# Altium project RL02.PrjPcb
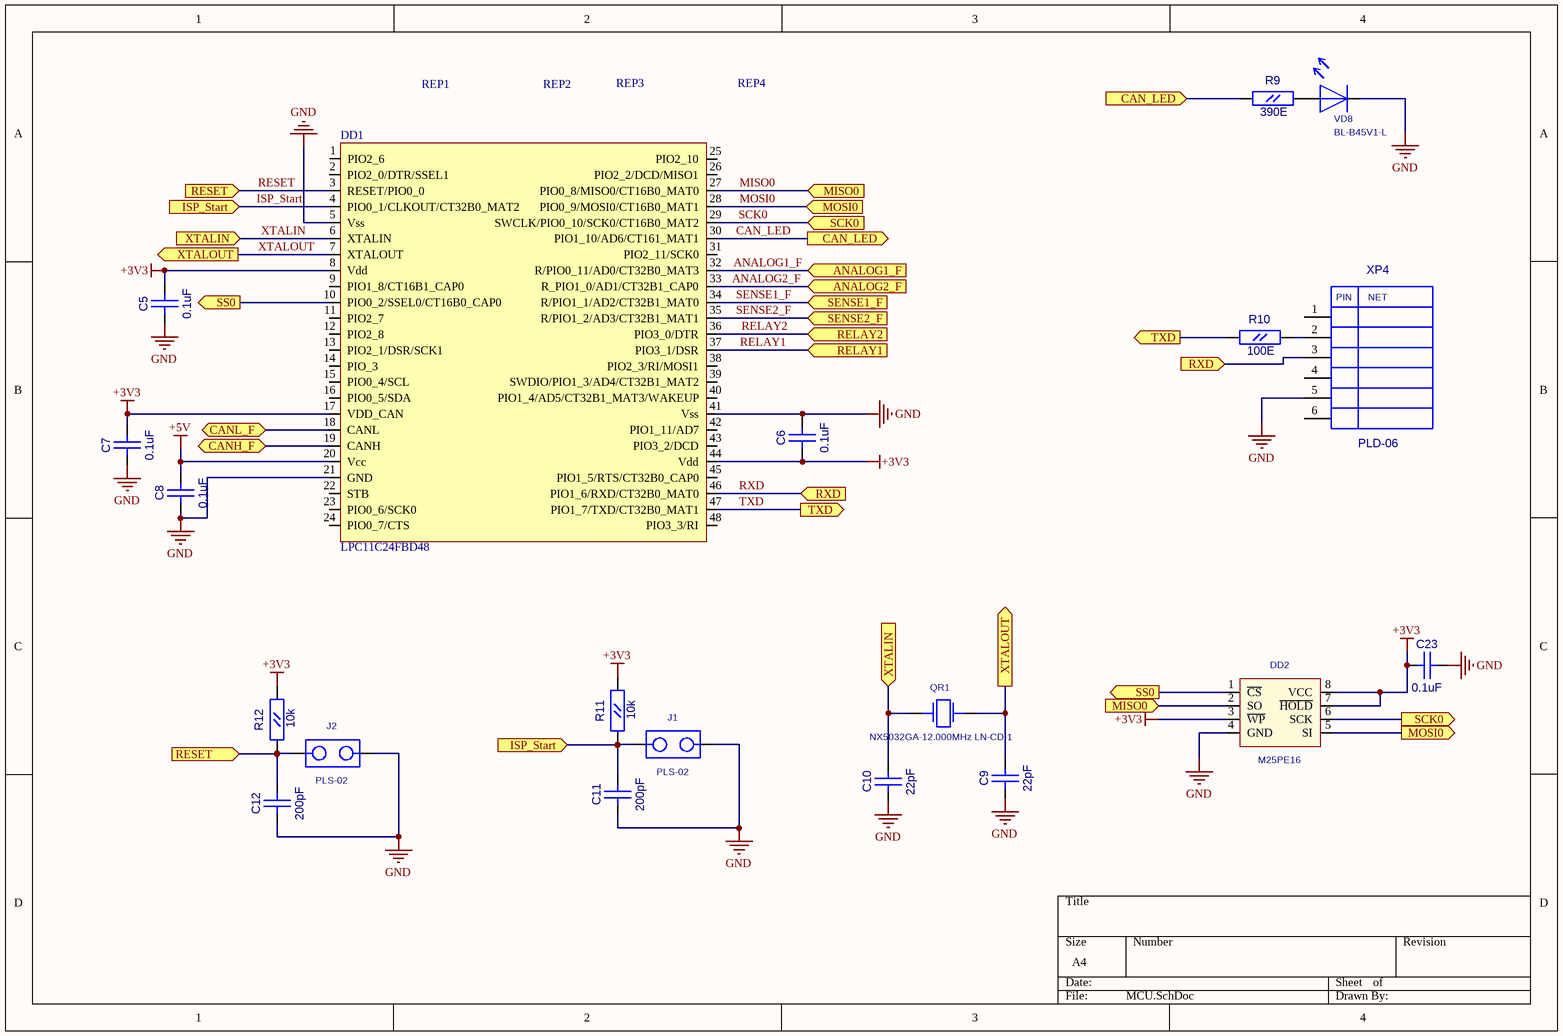
[diagram p0: MCU.SchDoc]
3 sheets, 65 parts. Net scope: flat (ports and power ports of the same name join across sheets).
Board file: RL02.PcbDoc
Sheets:
  MCU.SchDoc
  Power.SchDoc
  Relays.SchDoc

## Sheet MCU.SchDoc
size A4

### Parts
C5  0.1uF  [CC0603]
C6  0.1uF  [CC0603]
C7  0.1uF  [CC0603]
C8  0.1uF  [CC0603]
C9  22pF  [CC0603]
C10  22pF  [CC0603]
C11  200pF  [CC0603]
C12  200pF  [CC0603]
C23  0.1uF  [CC0603]
DD1  LPC11C24FBD48  [LQFP-48]
DD2  M25PE16  [EIAJ_SO8]
J1  PLS-02  [PLS-02]
J2  PLS-02  [PLS-02]
QR1  NX5032GA-12.000MHz LN-CD-1  [AC5032_2]
R9  390E  [RC0603]
R10  100E  [RC0603]
R11  10k  [RC0603]
R12  10k  [RC0603]
REP1  REPER_POINT_1.2  [REPER1.2]  (value not drawn)
REP2  REPER_POINT_1.2  [REPER1.2]  (value not drawn)
REP3  REPER_POINT_1.2  [REPER1.2]  (value not drawn)
REP4  REPER_POINT_1.2  [REPER1.2]  (value not drawn)
VD8  BL-B45V1-L  [LED3]
XP4  PLD-06  [PIN6]

### Ports
ANALOG1_F (in), ANALOG2_F (in), CAN_LED (in), CAN_LED (out), CANH_F, CANL_F, ISP_Start (in), MISO0 (in), MOSI0 (in), MOSI0 (out), RELAY1 (in), RELAY2 (in), RESET (in), RXD (in), SCK0 (in), SCK0 (out), SENSE1_F (in), SENSE2_F (in), SS0 (out), TXD (out), XTALIN (in), XTALOUT (out)

### Nets
+3V3: C5.2(B) C6.1(A) C7.2(B) C23.1(A) DD1.8(Vdd) DD1.17(VDD_CAN) DD1.44(Vdd) DD2.3(~{WP}) DD2.7(~{HOLD}) DD2.8(VCC) R11.2(B) R12.2(B)
+5V: C8.2(B) DD1.20(Vcc)
GND: C5.1(A) C6.2(B) C7.1(A) C8.1(A) C9.1(A) C10.1(A) C11.1(A) C12.1(A) C23.2(B) DD1.5(Vss) DD1.21(GND) DD1.41(Vss) DD2.4(GND) J1.2 J2.2 VD8.1 XP4.5
ANALOG1_F: DD1.32(R/PIO0_11/AD0/CT32B0_MAT3) ; port ANALOG1_F
ANALOG2_F: DD1.33(R_PIO1_0/AD1/CT32B1_CAP0) ; port ANALOG2_F
CAN_LED: DD1.30(PIO1_10/AD6/CT161_MAT1) R9.1(A) ; port CAN_LED
ISP_Start: C11.2(B) DD1.4(PIO0_1/CLKOUT/CT32B0_MAT2) J1.1 R11.1(A) ; port ISP_Start
MISO0: DD1.27(PIO0_8/MISO0/CT16B0_MAT0) DD2.2(SO) ; port MISO0
MOSI0: DD1.28(PIO0_9/MOSI0/CT16B0_MAT1) DD2.5(SI) ; port MOSI0
RELAY1: DD1.37(PIO3_1/DSR) ; port RELAY1
RELAY2: DD1.36(PIO3_0/DTR) ; port RELAY2
RESET: C12.2(B) DD1.3(RESET/PIO0_0) J2.1 R12.1(A) ; port RESET
RXD: DD1.46(PIO1_6/RXD/CT32B0_MAT0) XP4.3 ; port RXD
SCK0: DD1.29(SWCLK/PIO0_10/SCK0/CT16B0_MAT2) DD2.6(SCK) ; port SCK0
SENSE1_F: DD1.34(R/PIO1_1/AD2/CT32B1_MAT0) ; port SENSE1_F
SENSE2_F: DD1.35(R/PIO1_2/AD3/CT32B1_MAT1) ; port SENSE2_F
TXD: DD1.47(PIO1_7/TXD/CT32B0_MAT1) R10.1(A) ; port TXD
XTALIN: C10.2(B) DD1.6(XTALIN) QR1.1 ; port XTALIN
XTALOUT: C9.2(B) DD1.7(XTALOUT) QR1.2 ; port XTALOUT
NetDD1_10: DD1.10(PIO0_2/SSEL0/CT16B0_CAP0) DD2.1(~{CS}) ; port SS0
NetDD1_18: DD1.18(CANL) ; port CANL_F
NetDD1_19: DD1.19(CANH) ; port CANH_F
NetR9_2: R9.2(B) VD8.2
NetR10_2: R10.2(B) XP4.2

Not connected (* = marked no-connect by the designer): DD1 1(PIO2_6) 2(PIO2_0/DTR/SSEL1) 9(PIO1_8/CT16B1_CAP0) 11(PIO2_7) 12(PIO2_8) 13(PIO2_1/DSR/SCK1) 14(PIO_3) 15(PIO0_4/SCL) 16(PIO0_5/SDA) 22(STB) 23(PIO0_6/SCK0) 24(PIO0_7/CTS) 25(PIO2_10) 26(PIO2_2/DCD/MISO1) 31(PIO2_11/SCK0) 38(PIO2_3/RI/MOSI1) 39(SWDIO/PIO1_3/AD4/CT32B1_MAT2) 40(PIO1_4/AD5/CT32B1_MAT3/WAKEUP) 42(PIO1_11/AD7) 43(PIO3_2/DCD) 45(PIO1_5/RTS/CT32B0_CAP0) 48(PIO3_3/RI); REP1 1; REP2 1; REP3 1; REP4 1; XP4 1 4 6

### Notes on the sheet
- (in symbol PLD-06) PIN; NET

### Library data of the parts
C5-C12 C23 = CC0603
  C5-C8 C23: Value: 0.1uF
  C9 C10: Value: 22pF
  C11 C12: Value: 200pF
DD2 = S25FL016A0LMFI01: Value: M25PE16
QR1 = AC5032_2: AC5032/2; Value: NX5032GA-12.000MHz LN-CD-1
R9-R12 = RC0603
  R9: Value: 390E
  R10: Value: 100E
  R11 R12: Value: 10k
REP1-REP4 = REPER1.2: Value: REPER_POINT_1.2
VD8 = LED_3: Value: BL-B45V1-L
XP4 = PLD-06: PLD06; Value: *
DD1 = LPC11C24FBD48: Value: LPC11C24FBD48
J1 J2 = PLS-02: Value: *

## Sheet Power.SchDoc
size A4
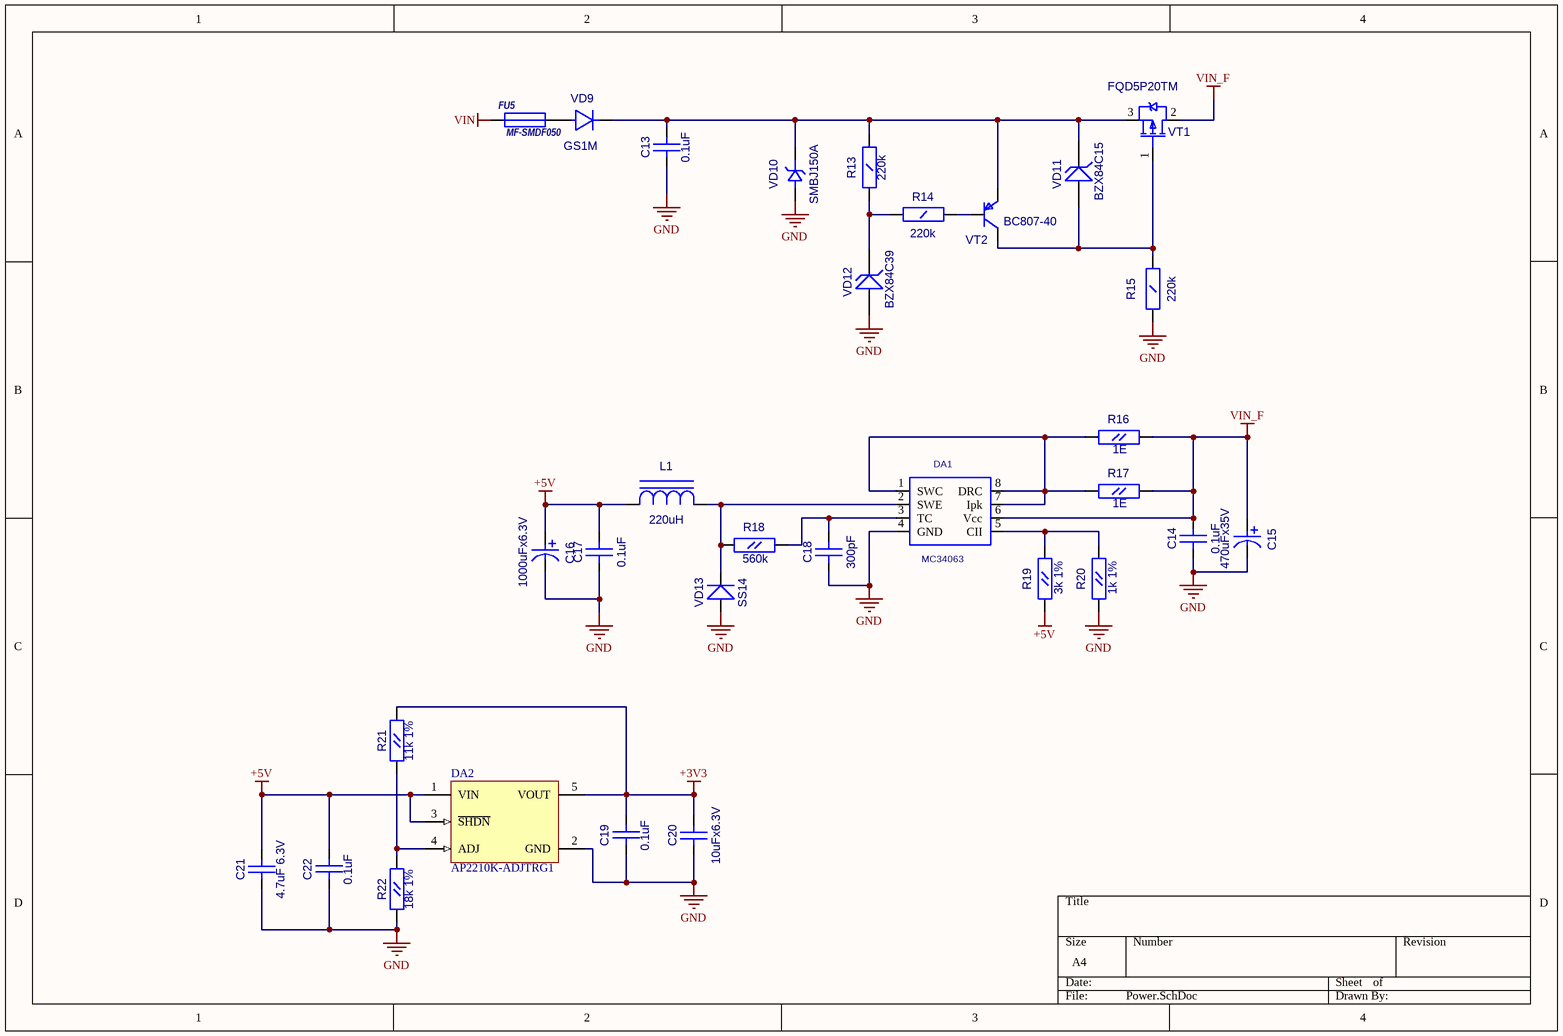
[diagram p1: Power.SchDoc]

### Parts
C13  0.1uF  [CC1206]
C14  0.1uF  [CC0603]
C15  470uFx35V  [CC16X10_CAP0.5(1)(Primary)]
C16  1000uFx6.3V  [CC8X3.5]
C17  0.1uF  [CC0603]
C18  300pF  [CC0603]
C19  0.1uF  [CC0603]
C20  10uFx6.3V  [CC0805]
C21  4.7uF 6.3V  [CC0805]
C22  0.1uF  [CC0603]
DA1  MC34063  [SO-8]
DA2  AP2210K-ADJTRG1  [SOT23-5]
FU5  MF-SMDF050  [MF-SMDF]
L1  220uH  [SDR0805]
R13  220k  [RC1206]
R14  220k  [RC1206]
R15  220k  [RC1206]
R16  1E  [RC0805]
R17  1E  [RC0805]
R18  560k  [RC0603]
R19  3k 1%  [RC0603]
R20  1k 1%  [RC0603]
R21  11k 1%  [RC0603]
R22  18k 1%  [RC0603]
VD9  GS1M  [SMA]
VD10  SMBJ150A  [SMB]
VD11  BZX84C15  [SOT-23(123)]
VD12  BZX84C39  [SOT-23(123)]
VD13  SS14  [SMA]
VT1  FQD5P20TM  [D-PAK(TO-252AA)]
VT2  BC807-40  [SOT-23(123)]

### Nets
+3V3: C19.1(A) C20.2(B) DA2.5(VOUT) R21.2(B)
+5V: C16.1 C17.2(B) C21.2(B) C22.1(A) DA2.1(VIN) DA2.3(~{SHDN}) L1.1(C) R19.1(A)
GND: C13.1(A) C14.1(A) C15.1 C16.2 C17.1(A) C18.1(A) C19.2(B) C20.1(A) C21.1(A) C22.2(B) DA1.4(GND) DA2.2(GND) R15.2(B) R20.1(A) R22.1(A) VD10.1(A) VD12.1(A) VD13.1(A)
VIN: FU5.1
VIN_F: C14.2(B) C15.2 DA1.6(Vcc) R16.2(B) R17.2(B) VT1.2(D)
NetC13_2: C13.2(B) R13.2(B) VD9.2(K) VD10.2(K) VD11.3(K) VT1.3(S) VT2.2(E)
NetC18_2: C18.2(B) DA1.3(TC) R18.2(B)
NetDA1_1: DA1.1(SWC) DA1.7(Ipk) DA1.8(DRC) R16.1(A) R17.1(A)
NetDA1_2: DA1.2(SWE) L1.2(A) R18.1(A) VD13.2(K)
NetDA1_5: DA1.5(CII) R19.2(B) R20.2(B)
NetDA2_4: DA2.4(ADJ) R21.1(A) R22.2(B)
NetFU5_2: FU5.2 VD9.1(A)
NetR13_1: R13.1(A) R14.1(A) VD12.3(K)
NetR14_2: R14.2(B) VT2.1(B)
NetR15_1: R15.1(A) VD11.1(A) VT1.1(G) VT2.3(C)

### Library data of the parts
C13 = CC1206: Value: 0.1uF
C14 C17-C19 C22 = CC0603
  C14 C17 C19 C22: Value: 0.1uF
  C18: Value: 300pF
C15 = CAP0.5(1): Value: 470uFx35V
C16 = CAP0.35: Value: 1000uFx6.3V
C20 C21 = CC0805
  C20: Value: 10uFx6.3V
  C21: Value: 4.7uF 6.3V
DA2 = MCP1824T-ADJE/OT: 300 mA, Low Voltage, Low Quiescent Current LDO Regulator, 5-Pin SOT-223, Extended Temperature, Tape and Reel; Published: 29-Jan-2009; DatasheetVersion: revA, Aug-2007; PackageVersion: revAW, Oct-2008; PackageReference: SOT-223-DC5; Publisher: Altium Limited; PackageDescription: 5-Lead Plastic Small Outline Transistor (DC) [SOT-223]; ComponentLink1Description: Manufacturer Link; ComponentLink1URL: http://www.microchip.com; ComponentLink2Description: Datasheet; ComponentLink2URL: http://ww1.microchip.com/downloads/en/DeviceDoc/22070a.pdf; ComponentLink3Description: Packaging Specification; ComponentLink3URL: http://ww1.microchip.com/downloads/en/PackagingSpec/00049AW.pdf
FU5 = MF-SMDF: Value: MF-SMDF050
L1 = SDR0805: Value: 220uH
R13-R15 = RC1206: Value: 220k
R16 R17 = RC0805: Value: 1E
R18-R22 = RC0603
  R18: Value: 560k
  R19: Value: 3k 1%
  R20: Value: 1k 1%
  R21: Value: 11k 1%
  R22: Value: 18k 1%
VD9 = GS1M: Value: {Value}
VD10 = SMBJ: Value: SMBJ150A
VD11 VD12 = BZX84: Zener Voltage Regulator Diode; Value: {Value}
VD13 = SS14: Schottky Rectifier; OriginalName: 10BQ100; ComponentField6: Published 8-Jun-2000, Modified 10-July-2000: SIM Model Added.; Value: SS14
VT1 = IRFR9220: HEXFET Power MOSFET; OriginalName: IRLML5103; ComponentField7: Published 8-Jun-2000; Value: FQD5P20TM
VT2 = BC857B: OriginalName: BC846BLT1; ComponentField7: Published 29-Sep-2000; Value: BC807-40
DA1 = MC34063: Value: *

## Sheet Relays.SchDoc
size A4
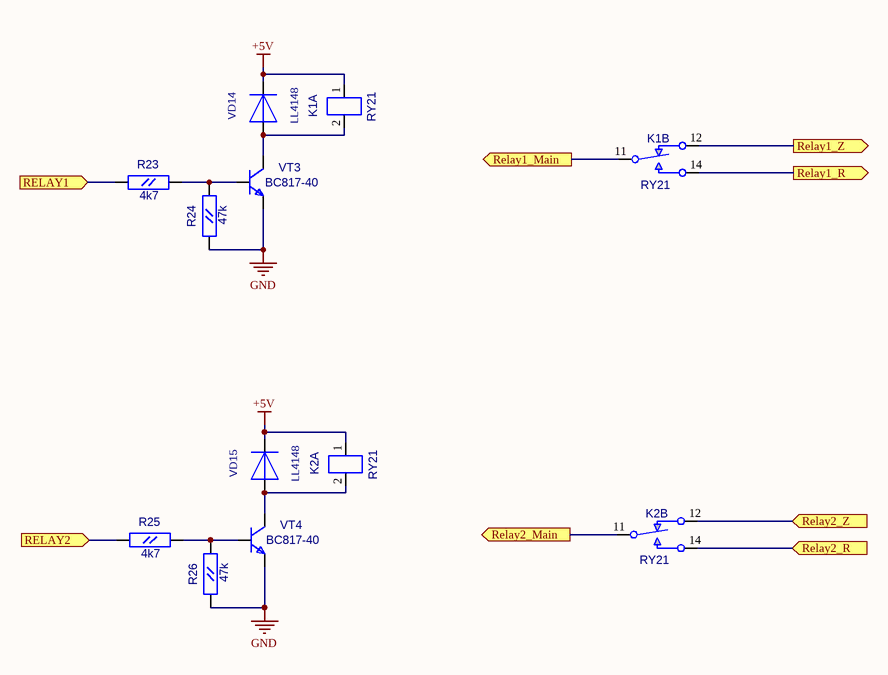
[diagram p2: Relays.SchDoc]

### Parts
K1  RY21  [RY21_RY21(Primary)]  (parts A,B of 2)
K2  RY21  [RY21_RY21(Primary)]  (parts A,B of 2)
R23  4k7  [RC0603]
R24  47k  [RC0603]
R25  4k7  [RC0603]
R26  47k  [RC0603]
VD14  LL4148  [SOD-80]
VD15  LL4148  [SOD-80]
VT3  BC817-40  [SOT-23(123)]
VT4  BC817-40  [SOT-23(123)]

### Ports
RELAY1 (in), Relay1_Main (out), Relay1_R (out), Relay1_Z (out), RELAY2 (in), Relay2_Main (out), Relay2_R (in), Relay2_Z (in)

### Nets
+5V: K1.1(L1) K2.1(L1) VD14.2(+) VD15.2(+)
GND: R24.1(A) R26.1(A) VT3.2(E) VT4.2(E)
RELAY1: R23.1(A) ; port RELAY1
RELAY2: R25.1(A) ; port RELAY2
NetK1_2: K1.2(C2) VD14.1(-) VT3.3(C)
NetK1_11: K1.11(C1) ; port Relay1_Main
NetK1_12: K1.12(C3) ; port Relay1_Z
NetK1_14: K1.14(C2) ; port Relay1_R
NetK2_2: K2.2(C2) VD15.1(-) VT4.3(C)
NetK2_11: K2.11(C1) ; port Relay2_Main
NetK2_12: K2.12(C3) ; port Relay2_Z
NetK2_14: K2.14(C2) ; port Relay2_R
NetR23_2: R23.2(B) R24.2(B) VT3.1(B)
NetR25_2: R25.2(B) R26.2(B) VT4.1(B)

### Library data of the parts
R23-R26 = RC0603
  R23 R25: Value: 4k7
  R24 R26: Value: 47k
VT3 VT4 = BC846BLT1: Value: {Value}; ComponentField7: Published 29-Sep-2000; OriginalName: BC846BLT1
K1 K2 = RY21: Value: *
VD14 VD15 = LL4148: Value: *

## Nets that join several sheets
+3V3: MCU (12 pins), Power (C19.1 C20.2 DA2.5 R21.2)
+5V: MCU (C8.2 DD1.20), Power (8 pins), Relays (K1.1 K2.1 VD14.2 VD15.2)
GND: MCU (17 pins), Power (18 pins), Relays (R24.1 R26.1 VT3.2 VT4.2)
RELAY1: MCU (DD1.37), Relays (R23.1)
RELAY2: MCU (DD1.36), Relays (R25.1)